# EAGLE design PBOARD (EAGLE 9.4.0)
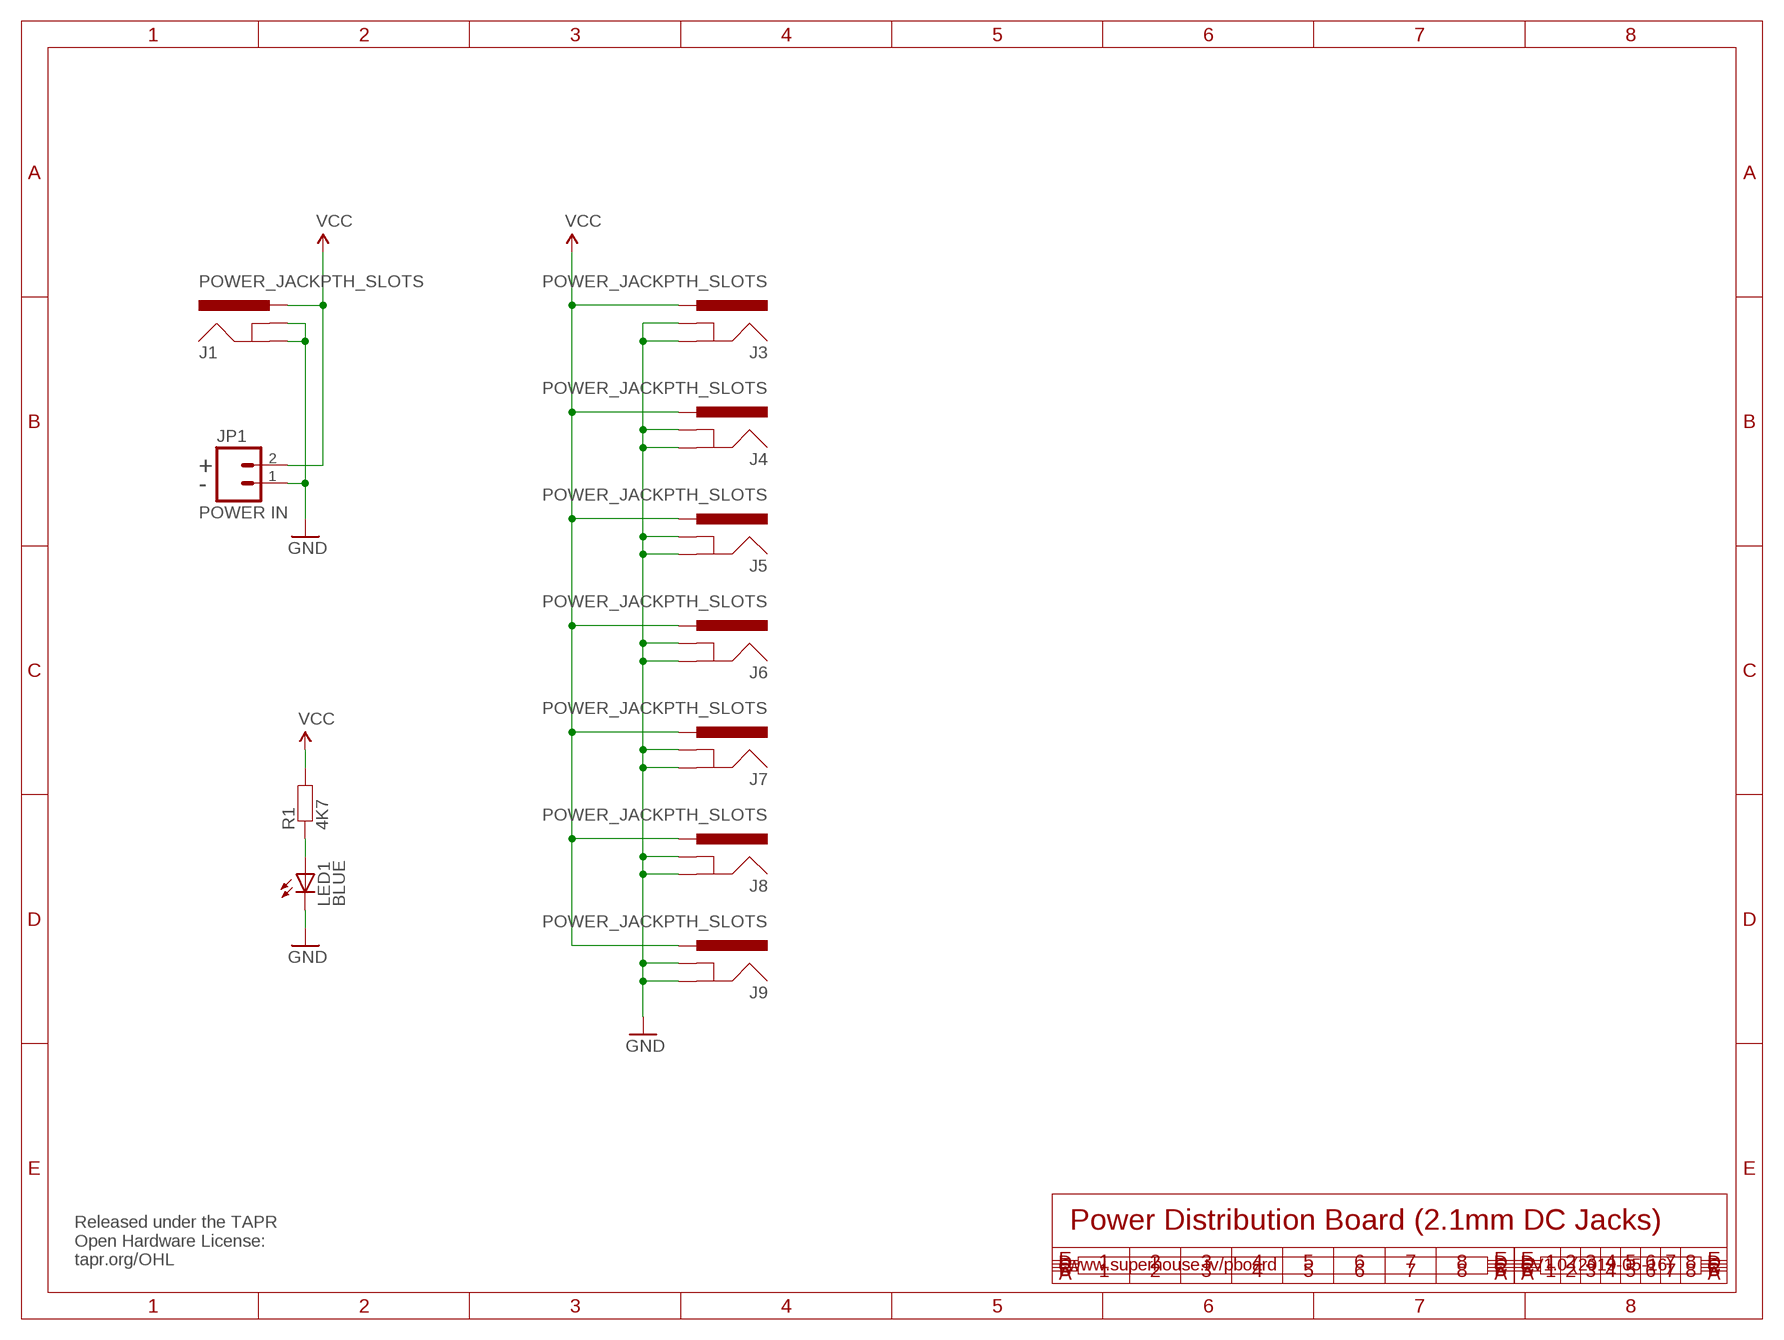
[diagram p0: schematic, sheet 1]

## Parts
J1  POWER_JACKPTH_SLOTS  [POWER_JACK_PTH_SLOTS]
J3  POWER_JACKPTH_SLOTS  [POWER_JACK_PTH_SLOTS]
J4  POWER_JACKPTH_SLOTS  [POWER_JACK_PTH_SLOTS]
J5  POWER_JACKPTH_SLOTS  [POWER_JACK_PTH_SLOTS]
J6  POWER_JACKPTH_SLOTS  [POWER_JACK_PTH_SLOTS]
J7  POWER_JACKPTH_SLOTS  [POWER_JACK_PTH_SLOTS]
J8  POWER_JACKPTH_SLOTS  [POWER_JACK_PTH_SLOTS]
J9  POWER_JACKPTH_SLOTS  [POWER_JACK_PTH_SLOTS]
JP1  POWER IN  M025MM  [SCREWTERMINAL-5MM-2]
LED1  BLUE  LED3MM  [LED3MM]
R1  4K7  RESISTORPTH1  [AXIAL-0.3]

## Nets
GND: J1.GND J1.GNDBREAK J3.GND J3.GNDBREAK J4.GND J4.GNDBREAK J5.GND J5.GNDBREAK J6.GND J6.GNDBREAK J7.GND J7.GNDBREAK J8.GND J8.GNDBREAK J9.GND J9.GNDBREAK JP1.1 LED1.K(C)
N$1: LED1.A R1.P$1
VCC: J1.PWR J3.PWR J4.PWR J5.PWR J6.PWR J7.PWR J8.PWR J9.PWR JP1.2 R1.P$2

## Notes on the sheet
- +
- -
- Power Distribution Board (2.1mm DC Jacks)
- Released under the TAPR
  Open Hardware License:
  tapr.org/OHL
- www.superhouse.tv/pboard | V1.0 (2019-05-16)

## Library data of the parts
J1 J3-J9 = freetronics-jon:POWER_JACK: Power Jack This is the standard 5.5mm barrel jack for power. The PTH is the most common, proven, reliable, footprint. All others are experimental. The Slot footprint only works if the mill layer is transmitted to the PCB fab house so be warned. Spark Fun Electronics SKU : PRT-00119. Mating wall wart : TOL-00298 (and others)
JP1 = freetronics-jon:M02: Header 2 Standard 2-pin 0.1" header. Use with straight break away headers (SKU : PRT-00116), right angle break away headers (PRT-00553), swiss pins (PRT-00743), machine pins (PRT-00117), and female headers (PRT-00115). Molex polarized connector foot print use with SKU : PRT-08233 with associated crimp pins and housings.
LED1 = freetronics-jon:LED: LEDs Standard schematic elements and footprints for 5mm, 3mm, 1206, and 0603 sized LEDs. 5mm - Spark Fun Electronics SKU : COM-00529 (and others)
R1 = freetronics-jon:RESISTOR: Resistor Basic schematic elements and footprints for 0603, 1206, and PTH 1/10th watt (small) resistors.

## Net classes
0 default: width 0.203 mm, drill 0.356 mm, clearance 0.152 mm
1 power: width 0.203 mm, clearance 0.152 mm

## Board
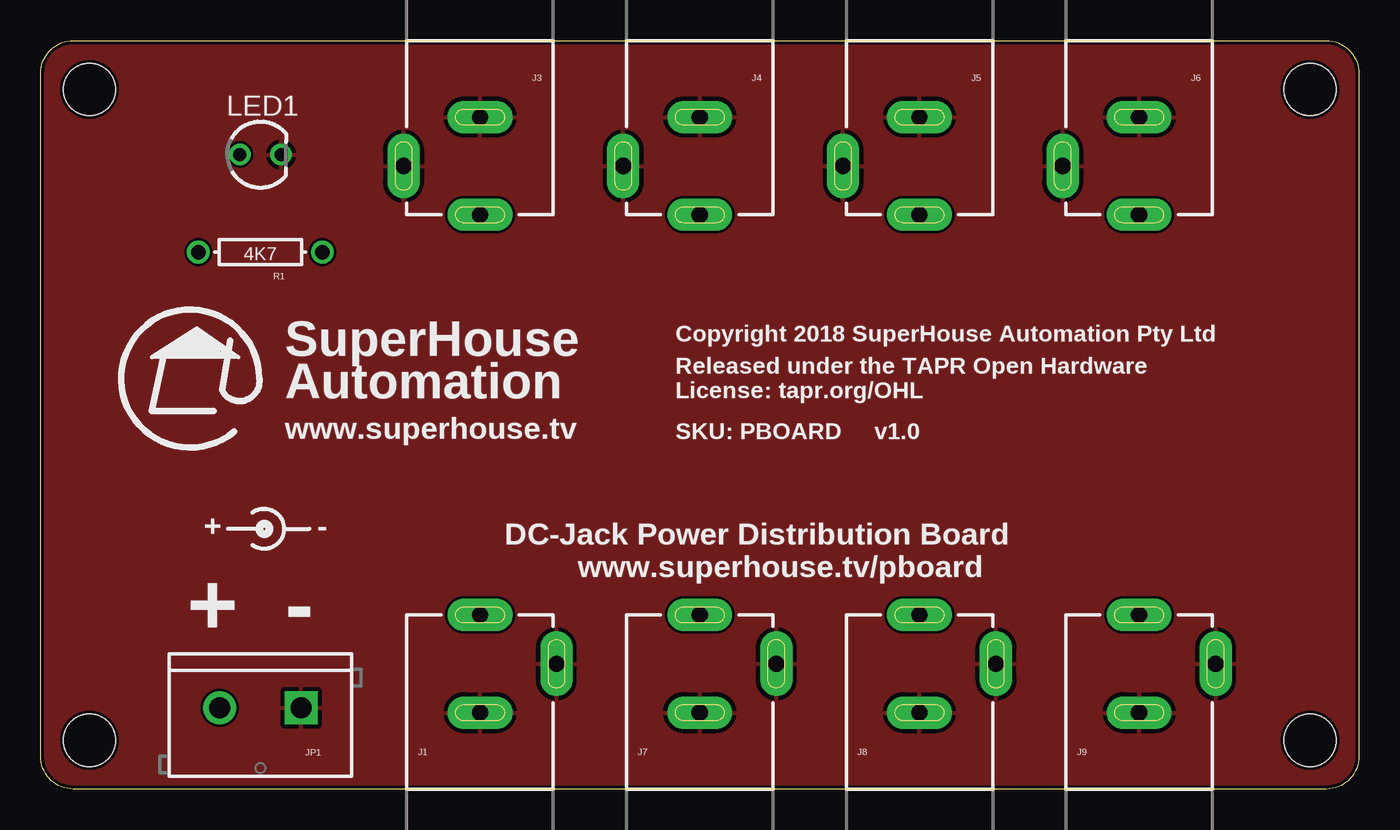
[diagram p1: board, top side]
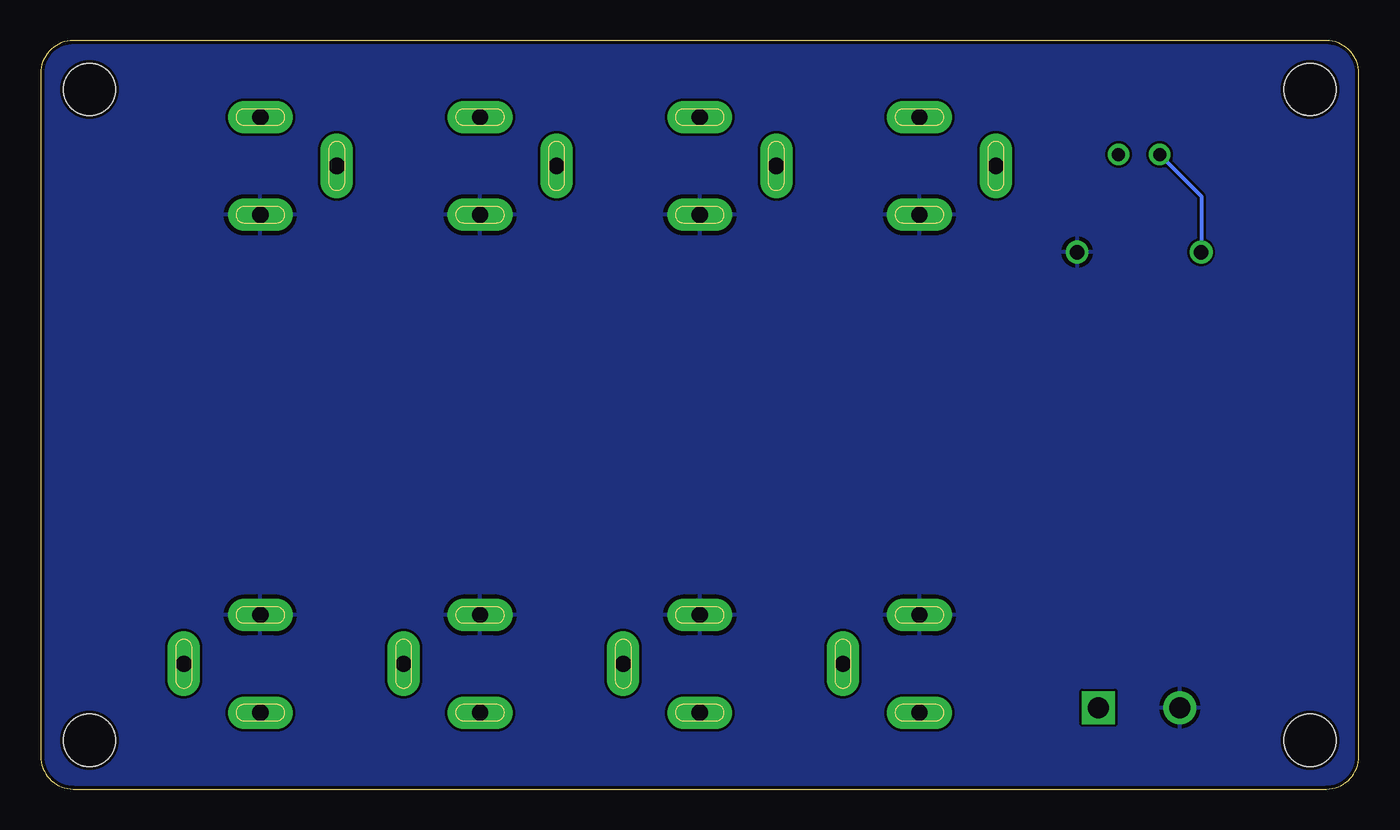
[diagram p2: board, bottom side, seen from below]

Size 81 x 46 mm. Coordinates in mm from the lower left corner, seen from the top.
Outline: 81,44 81,2 arc-90 79,0 2,0 arc-90 0,2 0,44 arc-90 2,46 79,46 arc-90 81,44
Copper layers (1*16): Top 0.035mm / dielectric 1.5mm / Bottom 0.035mm
Design rules "ElectroDragon_2layer_DRU_no_angle_20140221": minimum track width 6mil, minimum drill 12mil, track to track 6mil, track to pad 6mil, pad to pad 6mil, via to via 6mil, smd to smd 6mil, copper to edge 8mil, drill to drill 6mil, minimum pad ring 10mil, minimum via ring 6mil, stop-mask expansion 4mil, vias tented up to drill 100mil, thermal gap 10mil
Holes 3.2 mm at 3,43 78,43 3,3 78,3

### Footprints (pad centres in the part's own frame; a part is rotated, then mirrored left to right if it is on the bottom)
POWER_JACK_PTH_SLOTS = drill 1 pad 2 long: GND 0,7.7; GNDBREAK 4.7,10.7; PWR 0,13.7
SCREWTERMINAL-5MM-2 = drill 1.3 pad 2.032 square: 1 0,0 | drill 1.3 pad 2.032: 2 5,0
LED3MM = drill 0.813: A -1.27,0; K 1.27,0
AXIAL-0.3 = drill 0.9: P$1 -3.81,0; P$2 3.81,0

### Placement (x,y rotation side)
J1  27,-3 0 top
J3  27,49 180 top
J4  40.5,49 180 top
J5  54,49 180 top
J6  67.5,49 180 top
J7  40.5,-3 0 top
J8  54,-3 0 top
J9  67.5,-3 0 top
JP1  16,5 180 top
LED1  13.5,39 0 top
R1  13.5,33 0 top

### Tracks (layer width: path | path; a pad name or v marks a point on that pad's centre or on a via)
GND
  pour Top: 81,44 arc90 79,46 2,46 arc90 0,44 0,2 arc90 2,0 79,0 arc90 81,2
N$1
  Bottom 0.254: LED1.A 9.69,36.46 R1.P$1
VCC
  pour Bottom: 2,0 79,0 arc90 81,2 81,44 arc90 79,46 2,46 arc90 0,44 0,2 arc90

### Text on the board
tPlace: Copyright 2018 SuperHouse Automation Pty Ltd | SuperHouse / Automation | Released under the TAPR Open Hardware / License: tapr.org/OHL | www.superhouse.tv | SKU: PBOARD v1.0 | + | - | DC-Jack Power Distribution Board | www.superhouse.tv/pboard | + | -